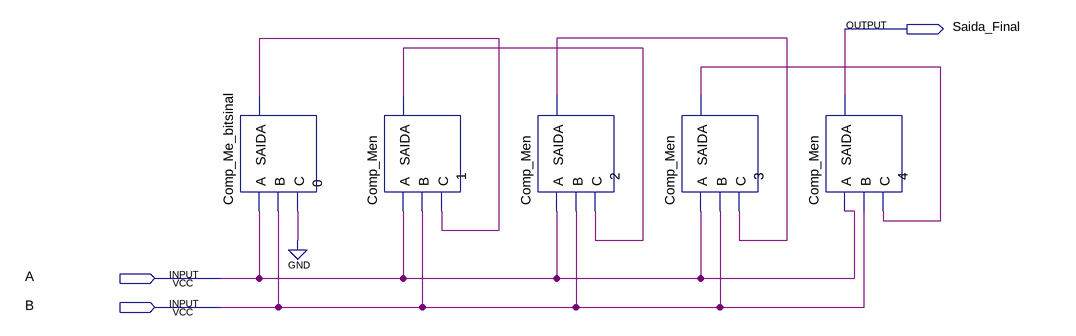
[diagram p0: schematic sheet]
// Quartus schematic Comp_Menor_5bits.bdf as structural Verilog: 5 symbols, 3 pins
module Comp_Menor_5bits (
  input  A,
  input  B,
  output Saida_Final
);

  wire n0_saida, n1_saida, n2_saida, n3_saida;

  Comp_Me_bitsinal u_0 (.A(A), .B(B), .C(1'b0), .SAIDA(n0_saida));
  Comp_Men u_1 (.A(A), .B(B), .C(n0_saida), .SAIDA(n1_saida));
  Comp_Men u_2 (.A(A), .B(B), .C(n1_saida), .SAIDA(n2_saida));
  Comp_Men u_3 (.A(A), .B(B), .C(n2_saida), .SAIDA(n3_saida));
  Comp_Men u_4 (.A(A), .B(B), .C(n3_saida), .SAIDA(Saida_Final));
endmodule
